# EAGLE design Motor_Driver_Card (EAGLE 7.6.0)

## Sheet 1 of 2
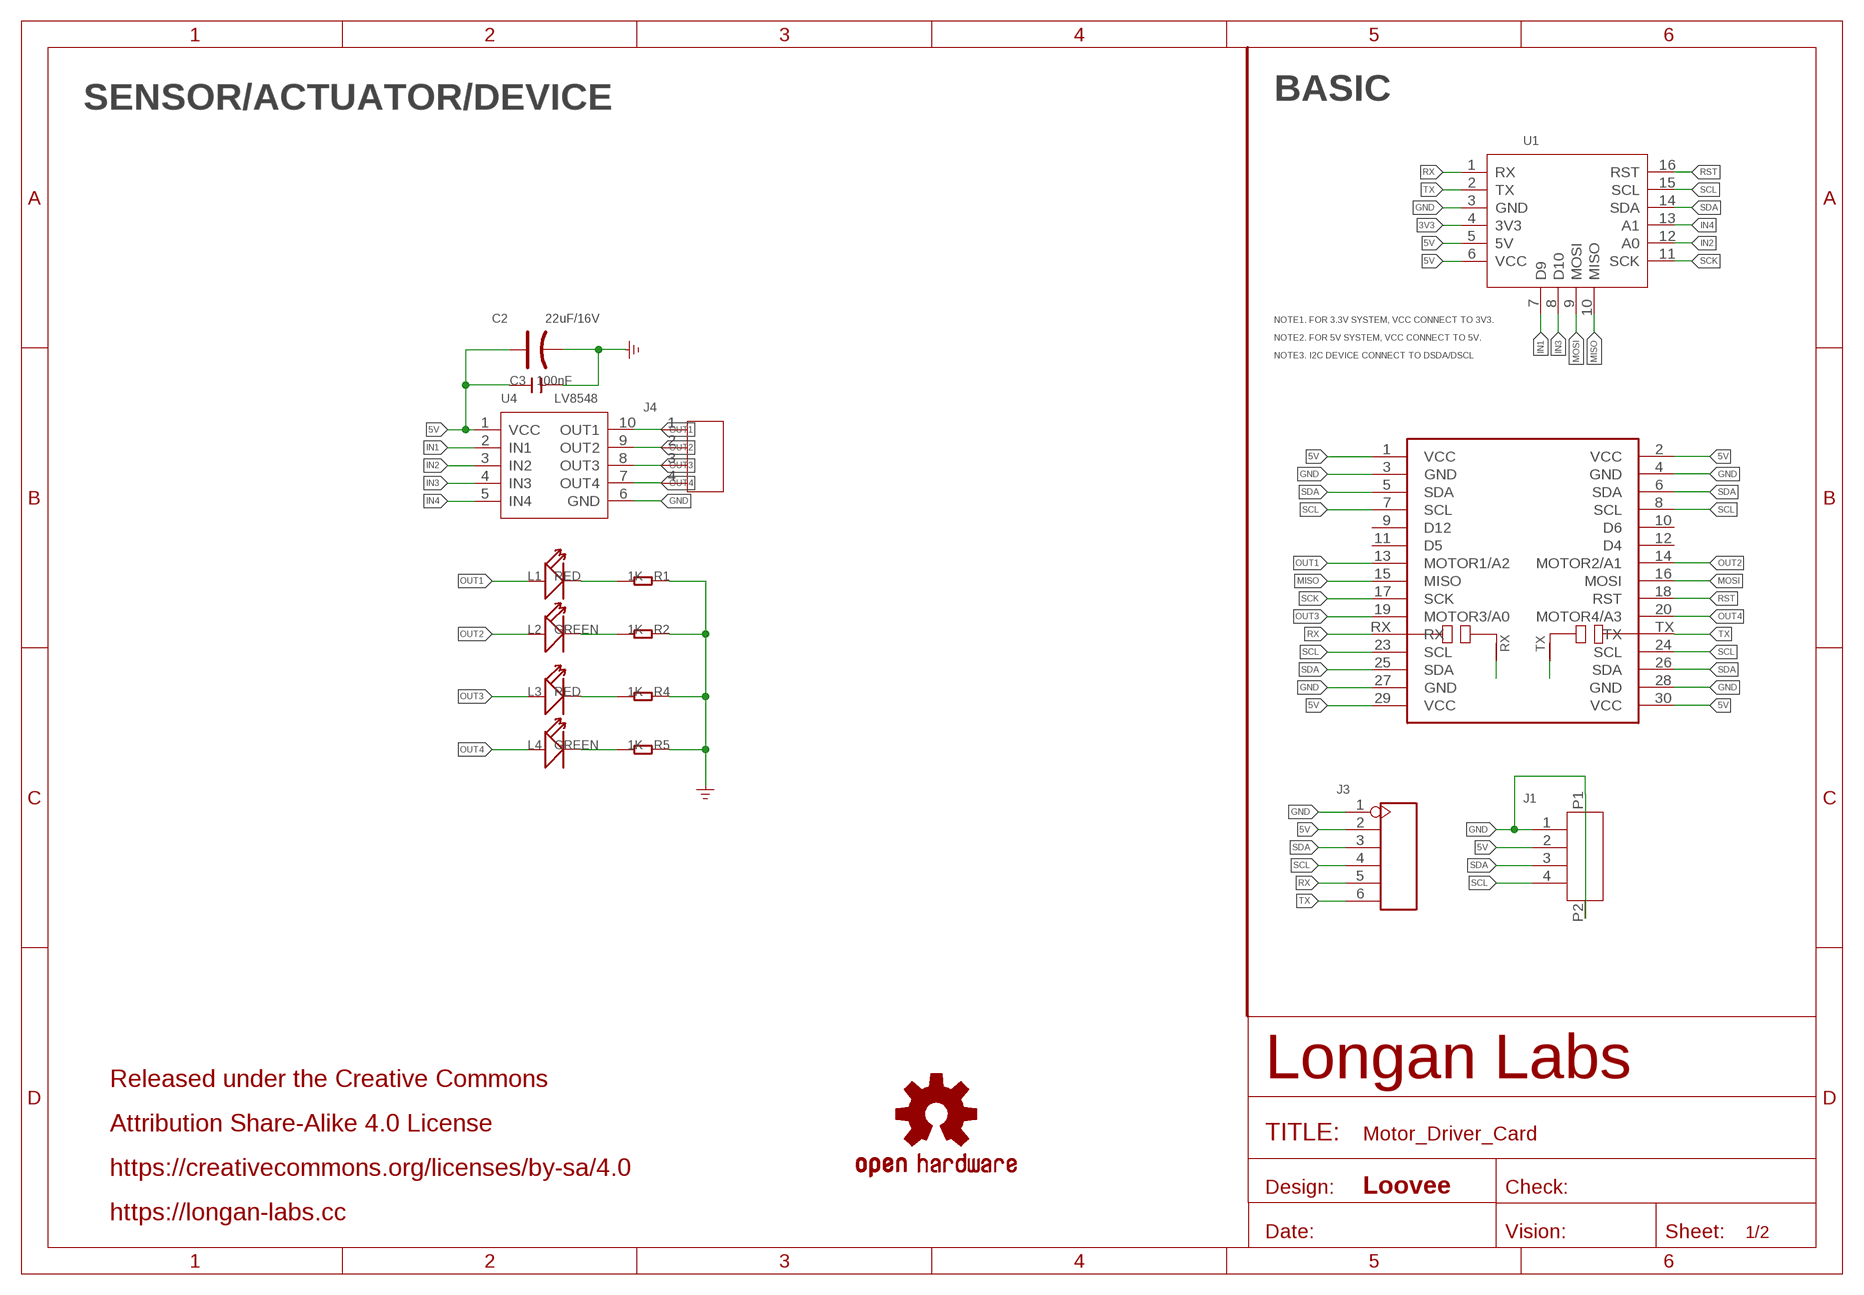
[diagram p0: schematic, sheet 1]

### Parts
C2  22uF/16V  CAP-POLAR-AVX-A  [AVX-A]
C3  100nF  C-0603  [C0603]
J1  HEADER-4P-1.0  [4P-1.0-90D]
J3  HEADER-6P-55/35MIL  [H6-2.54]
J4  SCREW-TERMINAL-4P'3.5'  [H4-3.5-14.0X7.0MM]
L1  RED  LED'0603'  [LED-0603]
L2  GREEN  LED'0603'  [LED-0603]
L3  RED  LED'0603'  [LED-0603]
L4  GREEN  LED'0603'  [LED-0603]
LOGO2  OSHW-LOGOS  [OSHW-LOGO-S]
MOUDLE2  MOUDLE-CARDS-UART'BOARD'  [MOUDLE-2X15P-UART]
R1  1K  R-0603  [R0603]
R2  1K  R-0603  [R0603]
R4  1K  R-0603  [R0603]
R5  1K  R-0603  [R0603]
U1  MOUDLE-CARDS  [16P-2.0-CARDS]
U4  LV8548  DRIVER-LV8548MC  [SOIC10-1.0-5X4X1.5MM]

### Nets
3V3: U1.4(3V3)
5V: C2.+ C3.1 J1.2 J3.2 MOUDLE2.1(VCC) MOUDLE2.2(VCC) MOUDLE2.29(VCC) MOUDLE2.30(VCC) U1.5(5V) U1.6(VCC) U4.1(VCC)
GND: C2.- C3.2 J1.1 J1.P1 J1.P2 J3.1 MOUDLE2.3(GND) MOUDLE2.4(GND) MOUDLE2.27(GND) MOUDLE2.28(GND) R1.1 R2.1 R4.1 R5.1 U1.3(GND) U4.6(GND) ; supply symbol labelled GND_POWER
IN1: U1.7(D9) U4.2(IN1)
IN2: U1.12(A0) U4.3(IN2)
IN3: U1.8(D10) U4.4(IN3)
IN4: U1.13(A1) U4.5(IN4)
MISO: MOUDLE2.15(MISO) U1.10(MISO)
MOSI: MOUDLE2.16(MOSI) U1.9(MOSI)
N$1: L1.- R1.2
N$2: L2.- R2.2
N$3: MOUDLE2.RX/N1(RX/N) MOUDLE2.RX/N2(RX/N)
N$4: L3.- R4.2
N$5: L4.- R5.2
N$6: MOUDLE2.TX/N1(TX/N) MOUDLE2.TX/N2(TX/N)
OUT1: J4.1 L1.+ MOUDLE2.13(MOTOR1/A2) U4.10(OUT1)
OUT2: J4.2 L2.+ MOUDLE2.14(MOTOR2/A1) U4.9(OUT2)
OUT3: J4.3 L3.+ MOUDLE2.19(MOTOR3/A0) U4.8(OUT3)
OUT4: J4.4 L4.+ MOUDLE2.20(MOTOR4/A3) U4.7(OUT4)
RST: MOUDLE2.18(RST) U1.16(RST)
RX: J3.5 MOUDLE2.RX U1.1(RX)
SCK: MOUDLE2.17(SCK) U1.11(SCK)
SCL: J1.4 J3.4 MOUDLE2.7(SCL) MOUDLE2.8(SCL) MOUDLE2.23(SCL) MOUDLE2.24(SCL) U1.15(SCL)
SDA: J1.3 J3.3 MOUDLE2.5(SDA) MOUDLE2.6(SDA) MOUDLE2.25(SDA) MOUDLE2.26(SDA) U1.14(SDA)
TX: J3.6 MOUDLE2.TX U1.2(TX)
Unconnected: MOUDLE2.9(D12) MOUDLE2.10(D6) MOUDLE2.11(D5) MOUDLE2.12(D4)

### Notes on the sheet
- SENSOR/ACTUATOR/DEVICE | BASIC
- NOTE1. FOR 3.3V SYSTEM, VCC CONNECT TO 3V3.
- NOTE2. FOR 5V SYSTEM, VCC CONNECT TO 5V.
- NOTE3. I2C DEVICE CONNECT TO DSDA/DSCL
- Released under the Creative Commons
- Attribution Share-Alike 4.0 License
- https://creativecommons.org/licenses/by-sa/4.0
- Loovee
- https://longan-labs.cc

## Sheet 2 of 2

## Library data of the parts
C2 = Discrete-new:CAP-POLAR: Electrolytic Capacitors,Tantalum Capacitors and Super Capacitors
C3 = Discrete:C*: Ceramic Capacitors
J1 = Longan-Connect:HEADER-4P-1.0
J3 = Connector-new:HEADER-6P
J4 = Connector-new:SCREW-TERMINAL-4P: 203000033
L1-L4 = Discrete:LED*
LOGO2 = SparkFun-Aesthetics:OSHW-LOGO: Open-Source Hardware (OSHW) Logo This logo indicates the piece of hardware it is found on incorporates a OSHW license and/or adheres to the definition of open source hardware found here: http://freedomdefined.org/OSHW
MOUDLE2 = Longan-moudle:MOUDLE-CARDS-UART
R1 R2 R4 R5 = Discrete:R*
U1 = MOUDLE-CARDS:MOUDLE-CARDS
U4 = LV8548:DRIVER-LV8548MC

## Board
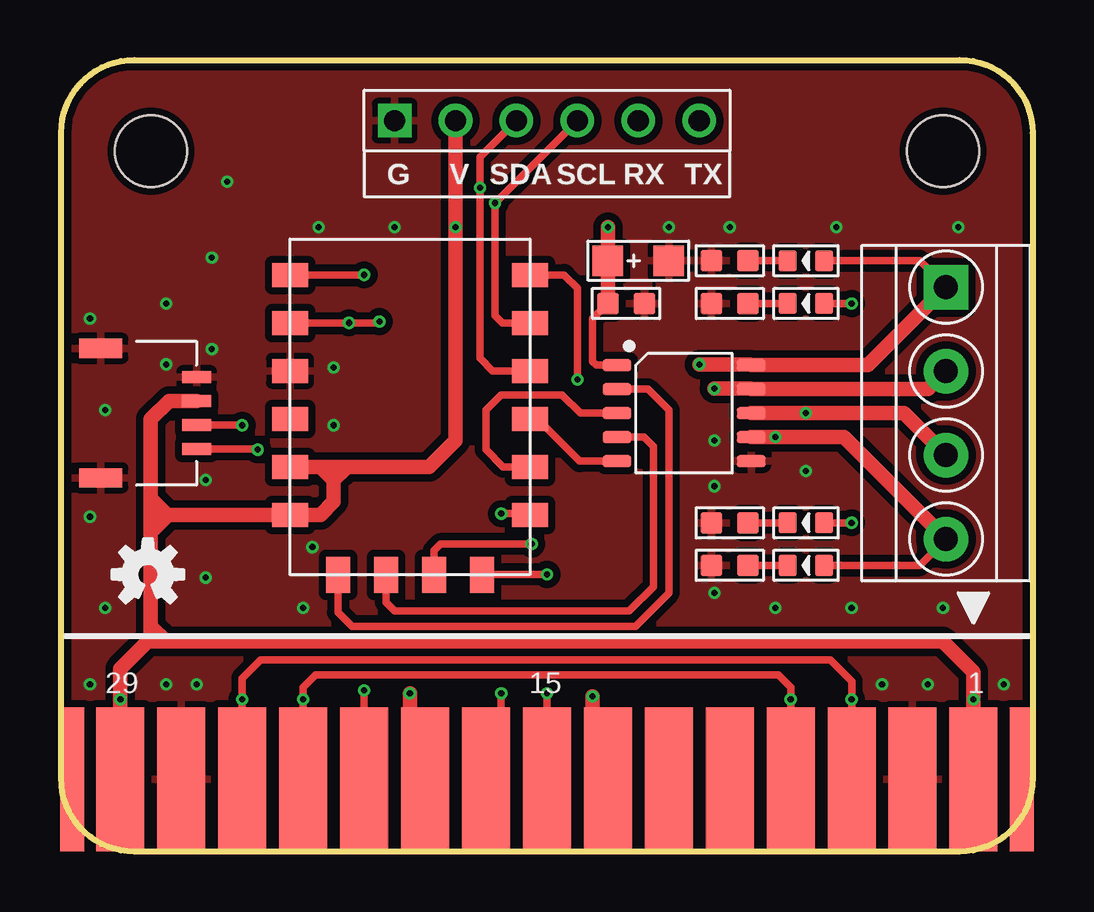
[diagram p1: board, top side]
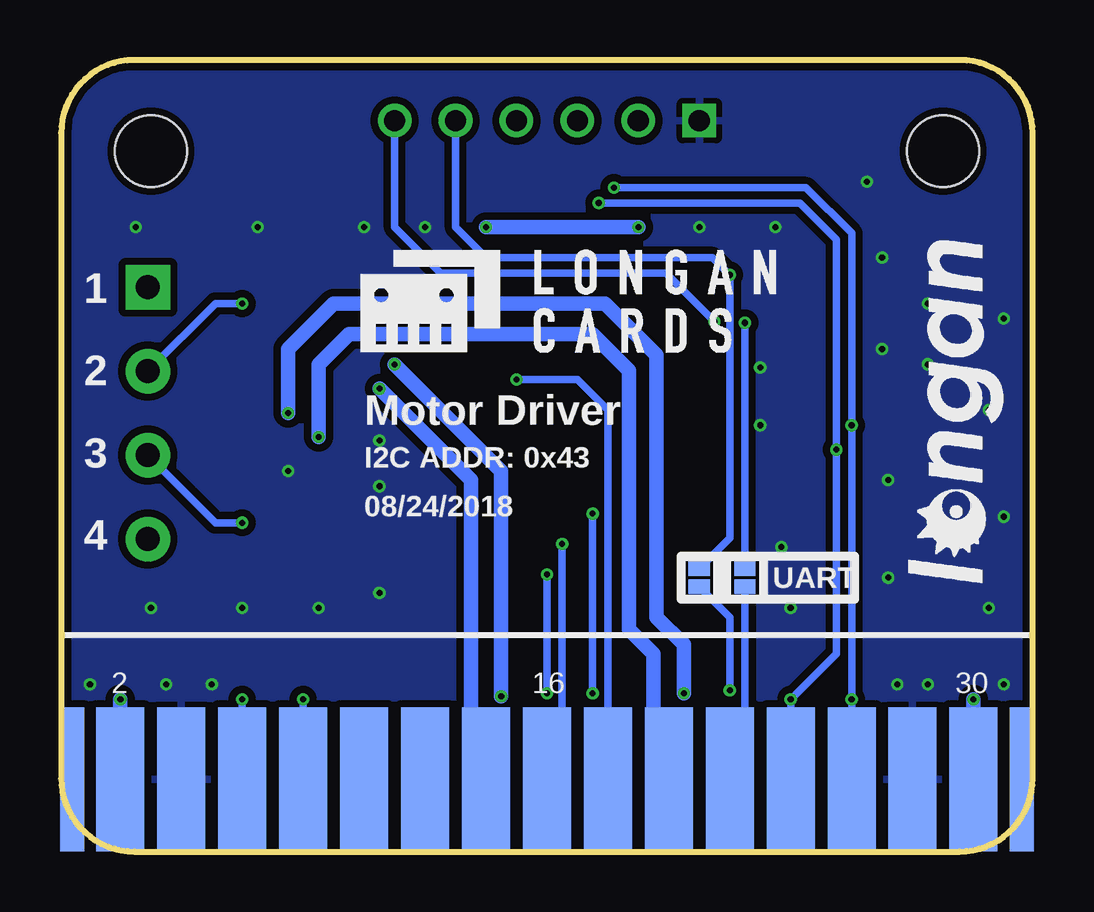
[diagram p2: board, bottom side, seen from below]

Size 40.5 x 33 mm. Coordinates in mm from the lower left corner, seen from the top.
Copper layers (1*16): Top 0.035mm / dielectric 1.5mm / Bottom 0.035mm
Design rules "SeeedStudio_2layer_DRU_no_angle_20140221": minimum track width 1mil, minimum drill 10mil, track to track 6mil, track to pad 6mil, pad to pad 6mil, via to via 6mil, smd to smd 0mil, copper to edge 10mil, drill to drill 10mil, minimum pad ring 4mil, minimum via ring 4mil, stop-mask expansion 2mil, vias tented up to drill 25mil, thermal gap 10mil

### Footprints (pad centres in the part's own frame; a part is rotated, then mirrored left to right if it is on the bottom)
AVX-A = smd 1.27 x 1.27: + -1.27,0; - 1.27,0
C0603 = smd 0.889 x 0.889: 1 -0.762,0; 2 0.762,0
4P-1.0-90D = smd 1.2 x 0.5: 1 0,1.5; 2 0,0.5; 3 0,-0.5; 4 0,-1.5 | smd 1.8 x 0.8: P1 -4,2.7; P2 -4,-2.7
H6-2.54 = drill 0.889 pad 1.397 square: 1 0,6.35 | drill 0.889 pad 1.397: 2 0,3.81; 3 0,1.27; 4 0,-1.27; 5 0,-3.81; 6 0,-6.35
H4-3.5-14.0X7.0MM = drill 1 pad 1.85 square: 1 -5.25,0 | drill 1 pad 1.85: 2 -1.75,0; 3 1.75,0; 4 5.25,0
LED-0603 = smd 0.762 x 0.889: + -0.762,0; - 0.762,0
MOUDLE-2X15P-UART = smd 2 x 6: 1 17.78,-13.492; 3 15.24,-13.492; 5 12.7,-13.492; 7 10.16,-13.492; 9 7.62,-13.492; 11 5.08,-13.492; 13 2.54,-13.492; 15 0,-13.492; 17 -2.54,-13.492; 19 -5.08,-13.492; 23 -10.16,-13.492; 25 -12.7,-13.492; 27 -15.24,-13.492; 29 -17.78,-13.492; RX/N2 -7.62,-13.492 | smd 2 x 6 bottom: 2 17.78,-13.492; 4 15.24,-13.492; 6 12.7,-13.492; 8 10.16,-13.492; 10 7.62,-13.492; 12 5.08,-13.492; 14 2.54,-13.492; 16 0,-13.492; 18 -2.54,-13.492; 20 -5.08,-13.492; 24 -10.16,-13.492; 26 -12.7,-13.492; 28 -15.24,-13.492; 30 -17.78,-13.492; TX/N2 -7.62,-13.492 | smd 1 x 6: P1 -19.8,-13.492; P4 19.8,-13.492 | smd 1 x 6 bottom: P2 -19.8,-13.492; P3 19.8,-13.492 | smd 0.889 x 0.61 bottom: RX -6.35,-4.699; RX/N1 -6.35,-5.461; TX -8.255,-4.699; TX/N1 -8.255,-5.461 | hole 3: -16.51,12.7; 16.51,12.7
R0603 = smd 0.889 x 0.889: 1 -0.762,0; 2 0.762,0
16P-2.0-CARDS = smd 1.5 x 1: 1 -5,5; 2 -5,3; 3 -5,1; 4 -5,-1; 5 -5,-3; 6 -5,-5; 11 5,-5; 12 5,-3; 13 5,-1; 14 5,1; 15 5,3; 16 5,5 | smd 1 x 1.5: 7 -3,-7.5; 8 -1,-7.5; 9 1,-7.5; 10 3,-7.5
SOIC10-1.0-5X4X1.5MM = smd 0.5 x 1.2: 1 -2,-2.8; 2 -1,-2.8; 3 0,-2.8; 4 1,-2.8; 5 2,-2.8; 6 2,2.8; 7 1,2.8; 8 0,2.8; 9 -1,2.8; 10 -2,2.8

### Placement (x,y rotation side)
C2  24.06,24.63 0 top
C3  23.55,22.85 0 top
J1  5.64,18.28 0 top
J3  20.25,30.47 90 top
J4  36.89,18.28 270 top
L1  31.05,24.63 180 top
L2  31.05,22.85 180 top
L3  31.05,13.71 180 top
L4  31.05,11.93 180 top
LOGO2  3.61,11.55 0 top
MOUDLE2  20.25,16.5 0 top
R1  27.87,24.63 0 top
R2  27.87,22.85 0 top
R4  27.87,13.71 0 top
R5  27.87,11.93 0 top
U1  14.54,19.04 0 top
U4  25.96,18.28 270 top
U$1  [LONGAN-CARDS-MIDDLE]  28.76,20.31 0 bottom
U$2  [LONGAN-SILK-SMALLER]  0.06,9.9 90 bottom

### Tracks (layer width: path | path; a pad name or v marks a point on that pad's centre or on a via)
5V  (via drill 0.25 pad 0.51)
  Top 0.305: U4.1 22.31,20.28 22.16,20.44 22.16,22.21 C3.1
  Top 0.61: 3.61,8.75 2.47,7.61 v2.47,6.34 MOUDLE2.30 | 3.61,8.75 4.38,8.75 | 4.38,8.75 36.76,8.75 38.03,7.48 38.03,7.1 v38.03,6.34 MOUDLE2.2 | J3.2 v16.44,26.02 16.44,17.14 15.34,16.04 11.49,16.04 | U1.5 10.82,16.04 | 10.82,16.04 11.49,16.04 | v22.79,26.02 C2.+ C3.1 | 4.46,14.04 U1.6 10.8,14.04 11.36,14.6 11.36,15.48 | 4.42,14.04 3.91,14.04 3.74,14.21 | J1.2 4.49,18.78 3.74,18.02 3.74,14.72 | 3.74,14.72 3.74,14.21 | 3.74,14.21 3.74,9.39 | 3.74,9.39 3.74,8.88 3.61,8.75 | 11.36,15.48 11.36,15.91 11.49,16.04 | 4.46,14.04 4.42,14.04 | 4.42,14.04 3.74,14.72 | 4.46,14.04 3.87,13.45 | 4.38,8.75 3.74,9.39 | 10.82,16.04 10.82,16.02 11.36,15.48 | 11.36,15.48 11.87,15.99 | MOUDLE2.30 2.47,1.89 2.6,1.77 2.6,2.88 MOUDLE2.30
  Bottom 0.61: v16.44,26.02 v22.79,26.02 | v2.47,6.34 MOUDLE2.30 | v38.03,6.34 MOUDLE2.2
GND  (via drill 0.25 pad 0.51)
  other vias: 4.38,6.97 5.64,6.97 34.22,6.97 36.12,6.97 11.36,20.18 11.36,17.77 1.84,18.41 4.38,20.31 6.28,20.95 1.2,22.21 1.2,13.96 1.84,10.15 1.2,6.97 27.23,10.79 27.23,15.23 27.23,17.14 31.05,15.87 25.33,26.02 27.87,26.02 32.31,26.02 37.39,26.02 36.76,10.15 32.95,10.15 29.77,10.15 39.3,6.97 13.9,26.02 10.72,26.02 6.91,27.93 6.28,24.76 4.38,22.85 6.03,11.42 10.09,10.15 10.47,12.69 6.03,15.48
  pour Top (isolate 0.305): -0.07,33.01 40.57,33.01 40.57,-0.01 -0.07,-0.01
  pour Bottom (isolate 0.305): -0.07,33.01 40.57,33.01 40.57,-0.01 -0.07,-0.01
IN1
  Top 0.305: U4.2 24.46,19.28 25.33,18.41 25.33,10.79 23.93,9.39 12.12,9.39 11.54,9.97 U1.7
IN2
  Top 0.305: U4.3 21.65,18.28 20.89,19.04 18.34,19.04 17.71,18.41 17.71,16.75 18.42,16.04 U1.12
IN3
  Top 0.305: U4.4 24.3,17.28 24.7,16.88 24.7,11.04 23.68,10.02 13.9,10.02 13.54,10.39 U1.8
IN4
  Top 0.305: U1.13 19.85,18.04 21.61,16.28 U4.5
MISO  (via drill 0.25 pad 0.51)
  Top 0.305: v20.25,11.55 U1.10 | v20.25,6.59 MOUDLE2.15
  Bottom 0.305: v20.25,6.59 v20.25,11.55
MOSI  (via drill 0.25 pad 0.51)
  Top 0.305: 15.8,12.05 15.55,11.8 15.55,11.56 U1.9 15.54,12.55 15.8,12.82 v19.61,12.82
  Bottom 0.305: v19.61,12.82 19.61,3.64 MOUDLE2.16
N$1
  Top 0.305: L1.- R1.2
N$2
  Top 0.305: L2.- R2.2
N$3  (via drill 0.25 pad 0.51)
  Top 0.305: MOUDLE2.RX/N2 v12.63,6.72
  Bottom 0.305: v12.63,6.72 12.63,9.77 MOUDLE2.RX/N1
N$4
  Top 0.305: L3.- R4.2
N$5
  Top 0.305: L4.- R5.2
N$6
  Bottom 0.305: MOUDLE2.TX/N1 11.99,3.04 12.63,2.4 12.5,2.4 12.38,2.53 12.38,2.75 MOUDLE2.TX/N2
OUT1  (via drill 0.25 pad 0.51)
  Top 0.305: L1.+ 35.79,24.63 J4.1 | 22.16,5.45 22.16,3.64 MOUDLE2.13
  Top 0.61: J4.1 33.64,20.28 U4.10 28.73,20.31 v26.6,20.31 | 22.16,5.45 v22.16,6.47
  Bottom 0.61: v22.16,6.47 22.16,15.87 v26.6,20.31
OUT2  (via drill 0.25 pad 0.51)
  Top 0.305: L2.+ v32.95,22.85
  Top 0.61: J4.2 36.14,19.28 U4.9 28.75,19.29 v27.23,19.29
  Bottom 0.305: v32.95,22.85 34.06,22.85 J4.2 | 23.43,5.2 23.43,3.64 MOUDLE2.14
  Bottom 0.61: 23.43,5.2 23.43,15.48 v27.23,19.29
OUT3  (via drill 0.25 pad 0.51)
  Top 0.305: L3.+ v32.95,13.71
  Top 0.61: U4.8 v31.05,18.28 35.14,18.28 J4.3 | v14.54,6.59 14.54,3.64 MOUDLE2.19
  Bottom 0.305: v32.95,13.71 34.06,13.71 J4.3
  Bottom 0.61: v31.05,18.28 31.05,20.95 29.14,22.85 17.84,22.85 15.68,20.69 15.68,9.77 14.54,8.63 v14.54,6.59
OUT4  (via drill 0.25 pad 0.51)
  Top 0.305: L4.+ 35.79,11.93 J4.4
  Top 0.61: U4.7 v29.77,17.28 32.64,17.28 J4.4
  Bottom 0.61: v29.77,17.28 29.77,20.31 28.51,21.58 18.34,21.58 16.82,20.06 16.82,9.26 15.8,8.24 15.8,6.47 15.8,5.96 15.8,3.64 MOUDLE2.20
RST  (via drill 0.25 pad 0.51)
  Top 0.305: U1.16 20.96,24.04 21.52,23.48 v21.52,19.68
  Bottom 0.305: v21.52,19.68 18.98,19.68 17.71,18.41 MOUDLE2.18
RX  (via drill 0.25 pad 0.51)
  Top 0.305: U1.1 v12.63,24.04
  Bottom 0.305: J3.5 24.06,26.02 22.79,24.76 13.34,24.76 v12.63,24.04 12.63,13.07 MOUDLE2.RX
SCK  (via drill 0.25 pad 0.51)
  Top 0.305: v18.34,6.59 18.34,3.64 MOUDLE2.17 | v18.34,14.09 19.45,14.09 U1.11
  Bottom 0.305: v18.34,6.59 v18.34,14.09
SCL  (via drill 0.25 pad 0.51)
  Top 0.305: U1.15 18.39,22.04 18.09,22.34 v18.09,27.04 J3.4 | J1.4 8.16,16.78 v8.19,16.75 | MOUDLE2.23 10.22,3.13 10.22,3.55 10.09,3.67 v10.09,6.34 10.09,6.85 10.6,7.36 29.9,7.36 30.41,6.85 30.41,6.59 v30.41,6.34 MOUDLE2.8
  Bottom 0.305: v18.09,27.04 9.71,27.04 8.19,25.52 v8.19,16.75 8.19,8.24 v10.09,6.34 MOUDLE2.23 | v30.41,6.34 MOUDLE2.8
SDA  (via drill 0.25 pad 0.51)
  Top 0.305: U1.14 17.98,20.04 17.46,20.56 v17.46,27.68 17.46,28.95 J3.3 | J1.3 v7.54,17.78 v7.55,17.77 | MOUDLE2.25 v7.55,6.34 7.55,7.23 8.31,7.99 32.06,7.99 32.95,7.1 32.95,6.72 v32.95,6.34 MOUDLE2.6
  Bottom 0.305: v17.46,27.68 9.46,27.68 7.55,25.77 v7.55,17.77 v7.55,6.34 MOUDLE2.25 | v32.95,6.34 MOUDLE2.6
TX  (via drill 0.25 pad 0.51)
  Top 0.305: U1.2 v11.99,22.04 13.22,22.04 v13.27,22.09
  Bottom 0.305: J3.6 26.6,26.02 24.7,24.12 15.3,24.12 v13.27,22.09 | MOUDLE2.TX v11.99,22.04

### Text on the board
tPlace: G | V | SDA | SCL | RX | TX
bPlace: 1 | 2 | Motor Driver | I2C ADDR: 0x43 | 3 | 08/24/2018 | 4